# Altium schematic sheet BMS.SchDoc: Wprowadź Tytuł
size A4; CheckedBy: Wprowadź sprawdzającego; DrawnBy: Wprowadź autora; Organization: Koło Naukowe Robotyków; Address1: Nowowiejska 24; Address2: 00-001; Address3: Wraszawa; Address4: Polska; Revision: Numer; Nazwa Arkusza: Wpisz nazwę arkusza; ProjectName: Nazwa Projektu
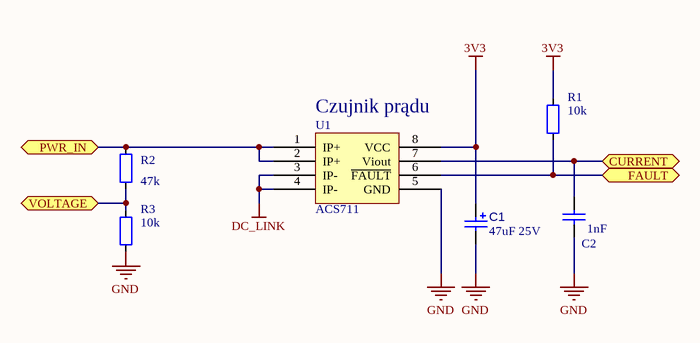
[diagram p0: BMS.SchDoc]

## Parts
C1  47uF 25V  [Con_SMD_5x5.5]
C2  1nF  [0603_CAP]
R1  10k  [0603]
R2  47k  [0603]
R3  10k  [0603]
U1  ACS711  [SO-8_N]

## Ports
CURRENT, FAULT, PWR_IN, VOLTAGE

## Nets
3V3: C1.1 R1.2 U1.8(VCC)
DC_LINK: U1.3(IP-) U1.4(IP-)
GND: C1.2 C2.1 R3.1 U1.5(GND)
CURRENT: C2.2 U1.7(Viout) ; port CURRENT
FAULT: R1.1 U1.6(~{FAULT}) ; port FAULT
PWR_IN: R2.2 U1.1(IP+) U1.2(IP+) ; port PWR_IN
VOLTAGE: R2.1 R3.2 ; port VOLTAGE

## Notes on the sheet
- (near U1) Czujnik prądu
- Narysował
- Sprawdził
- Projekt
- Date:
- Wersja
- Plik

## Library data of the parts
C1 = Cap_Pol: Polar capacitor; Value: 47uF 25V
C2 = Cap: Ceramic capacitor; Unit Price1: *; Unit Price2: *; Value: 1nF
R1-R3 = RES: Resistior
  R1 R3: Value: 10k
  R2: Value: 47k
U1 = ACS711: Current sensor. 12.5A or 25A at 3.3V; HelpURL: C:\Users\micha\Documents\Studia\Inżynierka\Elektronika\Datasheets\ACS711.pdf